# EAGLE schematic Main_wireless (EAGLE 7.1.0)
REV: 1.0
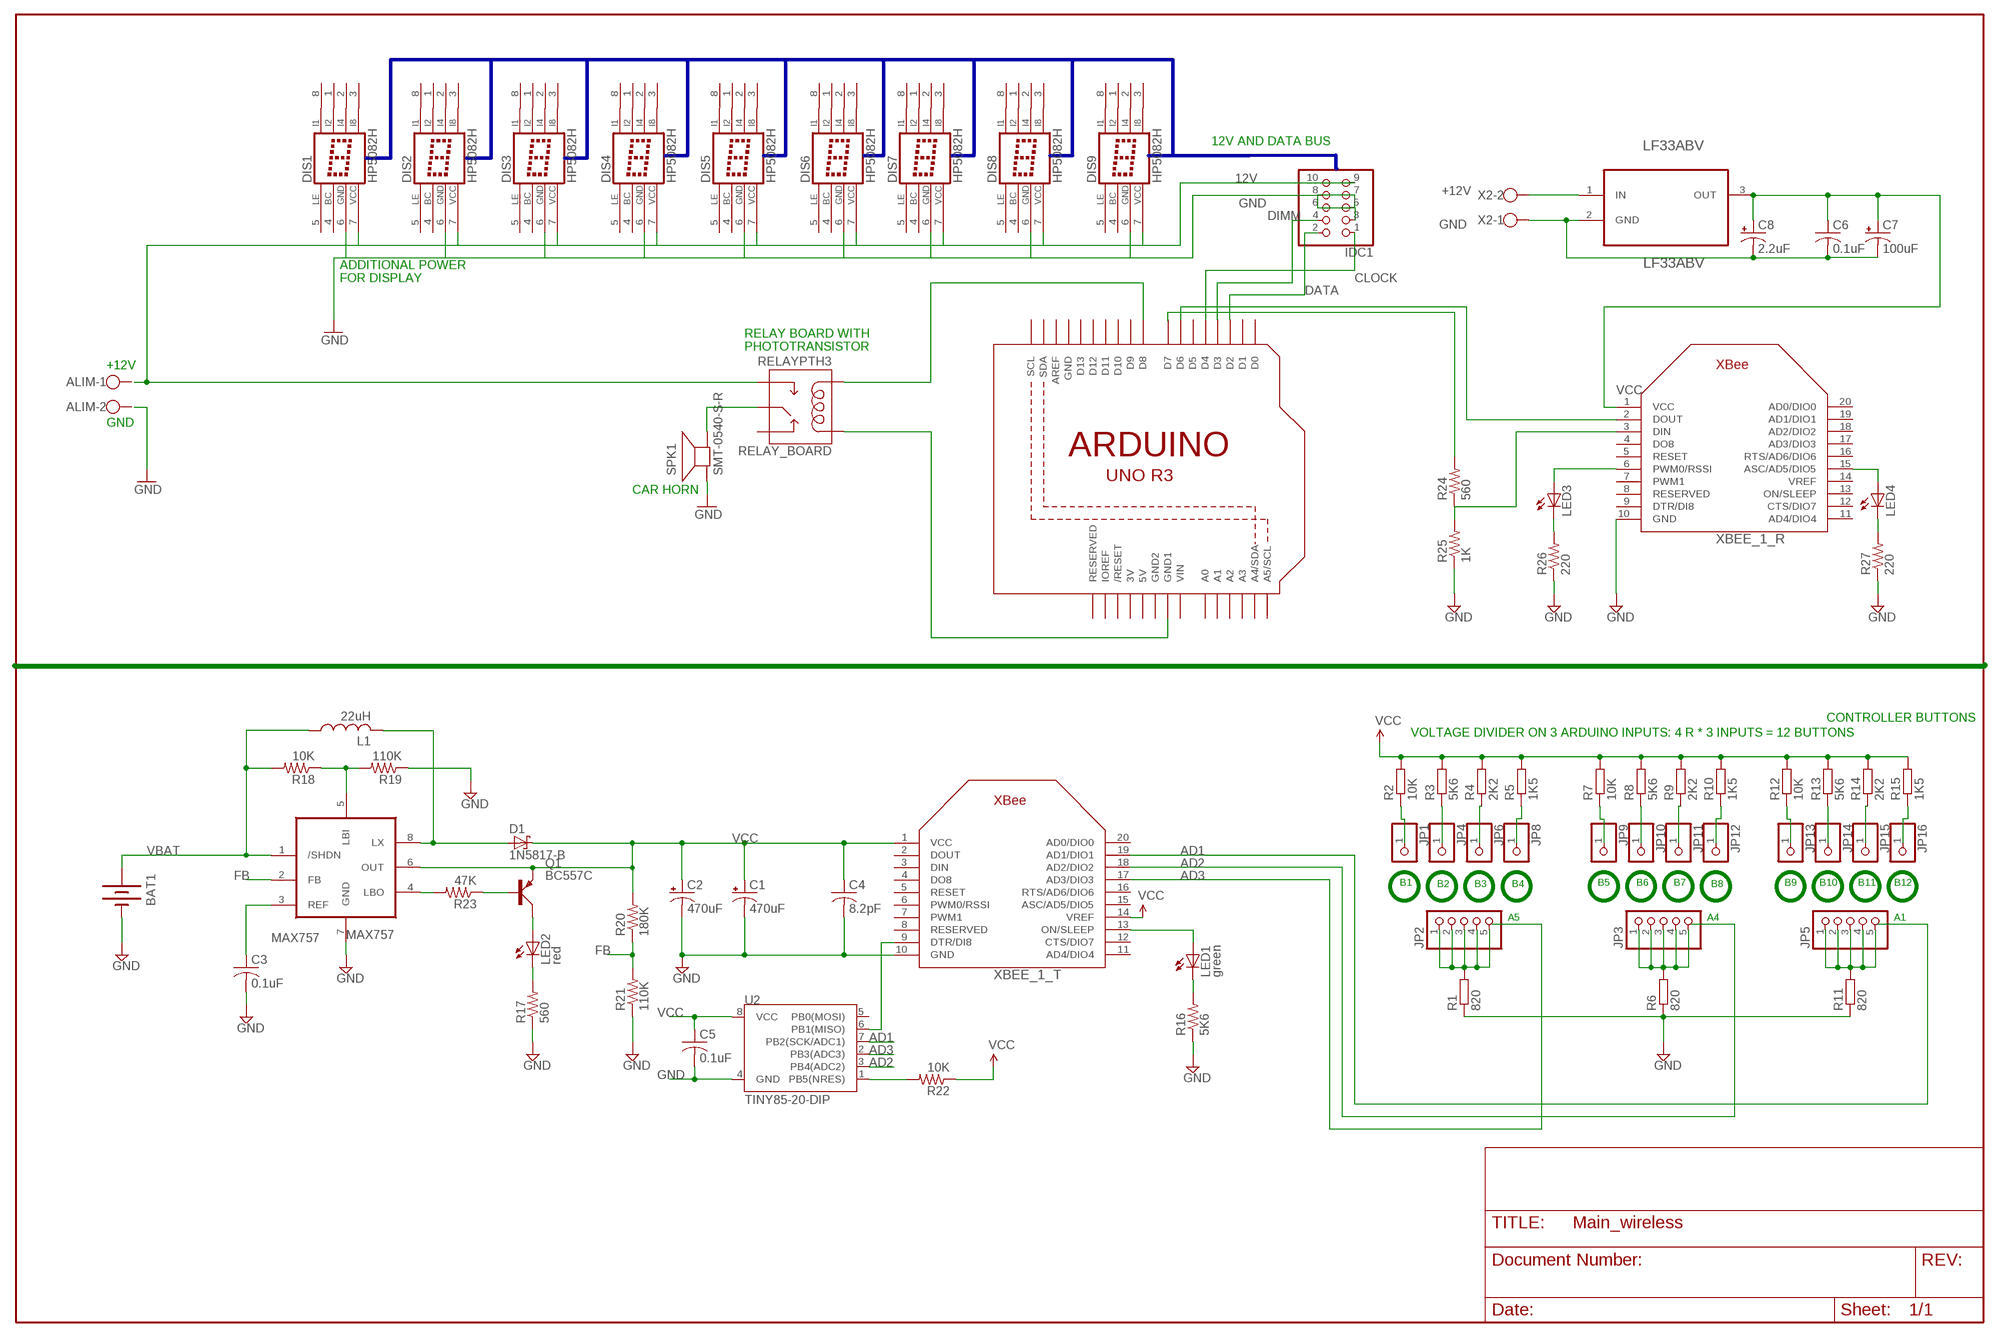
[diagram p0: schematic, sheet 1]

## Parts
ALIM  W237-102  [W237-102]
BAT1  BATTERY9V  [BATTCON_9V]
C1  470uF  CPOL-USE3.5-8  [E3,5-8]
C2  470uF  CPOL-USE3.5-8  [E3,5-8]
C3  0.1uF  C-US025-024X044  [C025-024X044]
C4  8.2pF  C-US025-024X044  [C025-024X044]
C5  0.1uF  C-US025-024X044  [C025-024X044]
C6  0.1uF  C-US025-024X044  [C025-024X044]
C7  100uF  CAP_POLPTH1  [CPOL-RADIAL-100UF-25V]
C8  2.2uF  CAP_POLPTH2  [CPOL-RADIAL-10UF-25V]
D1  1N5817-B  [DO41-7.6]
DIS1  HP5082H  [HP5082]
DIS2  HP5082H  [HP5082]
DIS3  HP5082H  [HP5082]
DIS4  HP5082H  [HP5082]
DIS5  HP5082H  [HP5082]
DIS6  HP5082H  [HP5082]
DIS7  HP5082H  [HP5082]
DIS8  HP5082H  [HP5082]
DIS9  HP5082H  [HP5082]
IDC1  PINHD-2X5  [2X05]
JP1  PINHD-1X1  [1X01]
JP2  PINHD-1X5  [1X05]
JP3  PINHD-1X5  [1X05]
JP4  PINHD-1X1  [1X01]
JP5  PINHD-1X5  [1X05]
JP6  PINHD-1X1  [1X01]
JP8  PINHD-1X1  [1X01]
JP9  PINHD-1X1  [1X01]
JP10  PINHD-1X1  [1X01]
JP11  PINHD-1X1  [1X01]
JP12  PINHD-1X1  [1X01]
JP13  PINHD-1X1  [1X01]
JP14  PINHD-1X1  [1X01]
JP15  PINHD-1X1  [1X01]
JP16  PINHD-1X1  [1X01]
L1  22uH  22R223C  [22R223C]
LED1  green  LED3MM  [LED3MM]
LED2  red  LED3MM  [LED3MM]
LED3  LED5MM  [LED5MM]
LED4  LED5MM  [LED5MM]
LF33ABV  LF33ABV  [TO254P450X1020X1935-3P]
MAX757  MAX757  [DIL08]
Q1  BC557C  [TO92D]
R1  820  R-EU_0207/12  [0207/12]
R2  10K  R-EU_0207/12  [0207/12]
R3  5K6  R-EU_0207/12  [0207/12]
R4  2K2  R-EU_0207/12  [0207/12]
R5  1K5  R-EU_0207/12  [0207/12]
R6  820  R-EU_0207/12  [0207/12]
R7  10K  R-EU_0207/12  [0207/12]
R8  5K6  R-EU_0207/12  [0207/12]
R9  2K2  R-EU_0207/12  [0207/12]
R10  1K5  R-EU_0207/12  [0207/12]
R11  820  R-EU_0207/12  [0207/12]
R12  10K  R-EU_0207/12  [0207/12]
R13  5K6  R-EU_0207/12  [0207/12]
R14  2K2  R-EU_0207/12  [0207/12]
R15  1K5  R-EU_0207/12  [0207/12]
R16  5K6  R-US_0207/10  [0207/10]
R17  560  R-US_0207/10  [0207/10]
R18  10K  R-US_0207/10  [0207/10]
R19  110K  R-US_0207/10  [0207/10]
R20  180K  R-US_0207/10  [0207/10]
R21  110K  R-US_0207/10  [0207/10]
R22  10K  R-US_0207/10  [0207/10]
R23  47K  R-US_0207/10  [0207/10]
R24  560  R-US_0207/10  [0207/10]
R25  1K  R-US_0207/10  [0207/10]
R26  220  R-US_0207/10  [0207/10]
R27  220  R-US_0207/10  [0207/10]
RELAY_BOARD  RELAYPTH3  [RELAY-T9A-2]
SPK1  SMT-0540-S-R  [SMT-0540-S-R]
U1  ARDUINOR3-DIMENSION  [ARDUINOR3]
U2  TINY85-20-DIP  ATTINY45TINY85-20-DIP  [DIP08]
X2  W237-102  [W237-102]
XBEE_1_R  XBEE  [XBEE]
XBEE_1_T  XBEE  [XBEE]

## Nets
12V: DIS1.7(VCC) DIS2.7(VCC) DIS3.7(VCC) DIS4.7(VCC) DIS5.7(VCC) DIS6.7(VCC) DIS7.7(VCC) DIS8.7(VCC) DIS9.7(VCC) IDC1.9 IDC1.10 RELAY_BOARD.NO
+12V [power]: LF33ABV.1(IN) X2.2
A1: JP3.1 JP3.2 JP3.3 JP3.4 JP3.5 R6.2
A2: JP5.1 JP5.2 JP5.3 JP5.4 JP5.5 R11.2
A3: JP2.1 JP2.2 JP2.3 JP2.4 JP2.5 R1.2
AD1: U2.7(PB2(SCK/ADC1)) XBEE_1_T.19(AD1/DIO1)
AD2: U2.3(PB4(ADC2)) XBEE_1_T.18(AD2/DIO2)
AD3: U2.2(PB3(ADC3)) XBEE_1_T.17(AD3/DIO3)
B1: JP1.1 R2.1
B2: JP4.1 R3.1
B3: JP6.1 R4.1
B4: JP8.1 R5.1
B5: JP9.1 R7.1
B6: JP10.1 R8.1
B7: JP11.1 R9.1
B8: JP12.1 R10.1
B9: JP13.1 R12.1
B10: JP14.1 R13.1
B11: JP15.1 R14.1
B12: JP16.1 R15.1
CLOCK: IDC1.1 U1.D4
DATA: IDC1.2 U1.D2
DIMM: IDC1.4 U1.D3
FB: MAX757.2(FB) R20.1 R21.2
GND: BAT1.- C1.- C2.- C3.2 C4.2 C5.2 C6.2 C7.2(-) C8.2(-) DIS1.6(GND) DIS2.6(GND) DIS3.6(GND) DIS4.6(GND) DIS5.6(GND) DIS6.6(GND) DIS7.6(GND) DIS8.6(GND) DIS9.6(GND) IDC1.3 IDC1.5 IDC1.6 IDC1.7 IDC1.8 LF33ABV.2(GND) MAX757.7(GND) R1.1 R6.1 R11.1 R16.1 R17.1 R19.1 R21.1 R25.1 R26.1 R27.1 SPK1.-(+) U2.4(GND) X2.1 XBEE_1_R.10(GND) XBEE_1_T.10(GND)
GND1: RELAY_BOARD.COIL1 U1.GND1
N$1: RELAY_BOARD.MAIN SPK1.+(-)
N$2: RELAY_BOARD.COIL2 U1.D8
N$3: LED3.K(C) R26.2
N$4: LED3.A XBEE_1_R.6(PWM0/RSSI)
N$5: R24.1 R25.2 XBEE_1_R.3(DIN)
N$6: U2.6(PB1(MISO)) XBEE_1_T.9(DTR/DI8)
N$8: LED1.A XBEE_1_T.13(ON/SLEEP)
N$9: LED1.K(C) R16.2
N$10: D1.A L1.P$2 MAX757.8(LX)
N$11: C3.1 MAX757.3(REF)
N$12: MAX757.5(LBI) R18.1 R19.2
N$13: R22.2 U2.1(PB5(NRES))
N$14: MAX757.4(LBO) R23.2
N$15: LED2.K(C) R17.2
N$16: Q1.B R23.1
N$17: LED2.A Q1.C
N$18: LED4.A XBEE_1_R.15(ASC/AD5/DIO5)
N$19: LED4.K(C) R27.2
N$20: R24.2
TX-3.3V-TO-MICRO: U1.D6 XBEE_1_R.2(DOUT)
VBAT [power]: BAT1.+ L1.P$1 MAX757.1(/SHDN) R18.2
VCC: C1.+ C2.+ C4.1 C5.1 C6.1 C7.1(+) C8.1(+) D1.C LF33ABV.3(OUT) MAX757.6(OUT) Q1.E R2.2 R3.2 R4.2 R5.2 R7.2 R8.2 R9.2 R10.2 R12.2 R13.2 R14.2 R15.2 R20.2 R22.1 U2.8(VCC) XBEE_1_R.1(VCC) XBEE_1_T.1(VCC) XBEE_1_T.14(VREF)
Unconnected: ALIM.1 ALIM.2 DIS1.1(I2) DIS1.2(I4) DIS1.3(I8) DIS1.4(BC) DIS1.5(LE) DIS1.8(I1) DIS2.1(I2) DIS2.2(I4) DIS2.3(I8) DIS2.4(BC) DIS2.5(LE) DIS2.8(I1) DIS3.1(I2) DIS3.2(I4) DIS3.3(I8) DIS3.4(BC) DIS3.5(LE) DIS3.8(I1) DIS4.1(I2) DIS4.2(I4) DIS4.3(I8) DIS4.4(BC) DIS4.5(LE) DIS4.8(I1) DIS5.1(I2) DIS5.2(I4) DIS5.3(I8) DIS5.4(BC) DIS5.5(LE) DIS5.8(I1) DIS6.1(I2) DIS6.2(I4) DIS6.3(I8) DIS6.4(BC) DIS6.5(LE) DIS6.8(I1) DIS7.1(I2) DIS7.2(I4) DIS7.3(I8) DIS7.4(BC) DIS7.5(LE) DIS7.8(I1) DIS8.1(I2) DIS8.2(I4) DIS8.3(I8) DIS8.4(BC) DIS8.5(LE) DIS8.8(I1) DIS9.1(I2) DIS9.2(I4) DIS9.3(I8) DIS9.4(BC) DIS9.5(LE) DIS9.8(I1) RELAY_BOARD.NC U1.A0 U1.A1 U1.A2 U1.A3 U1.A4(A4/SDA) U1.A5(A5/SCL) U1.AREF U1.D0 U1.D1 U1.D5 U1.D7 U1.D9 U1.D10 U1.D11 U1.D12 U1.D13 U1.IOREF U1.RESERVED U1.RESET(/RESET) U1.SCL U1.SDA U2.5(PB0(MOSI)) XBEE_1_R.4(DO8) XBEE_1_R.5(RESET) XBEE_1_R.7(PWM1) XBEE_1_R.8(RESERVED) XBEE_1_R.9(DTR/DI8) XBEE_1_R.11(AD4/DIO4) XBEE_1_R.12(CTS/DIO7) XBEE_1_R.13(ON/SLEEP) XBEE_1_R.14(VREF) XBEE_1_R.16(RTS/AD6/DIO6) XBEE_1_R.17(AD3/DIO3) XBEE_1_R.18(AD2/DIO2) XBEE_1_R.19(AD1/DIO1) XBEE_1_R.20(AD0/DIO0) XBEE_1_T.2(DOUT) XBEE_1_T.3(DIN) XBEE_1_T.4(DO8) XBEE_1_T.5(RESET) XBEE_1_T.6(PWM0/RSSI) XBEE_1_T.7(PWM1) XBEE_1_T.8(RESERVED) XBEE_1_T.11(AD4/DIO4) XBEE_1_T.12(CTS/DIO7) XBEE_1_T.15(ASC/AD5/DIO5) XBEE_1_T.16(RTS/AD6/DIO6) XBEE_1_T.20(AD0/DIO0)

## Buses
B$1
B$2

## Notes on the sheet
- 12V AND DATA BUS
- ADDITIONAL POWER
  FOR DISPLAY
- RELAY BOARD WITH
  PHOTOTRANSISTOR
- +12V
- GND
- CAR HORN
- CONTROLLER BUTTONS
- VOLTAGE DIVIDER ON 3 ARDUINO INPUTS: 4 R * 3 INPUTS = 12 BUTTONS
- B1 | B2 | B3 | B4 | B5 | B6 | B7 | B8 | B9 | B10 | B11 | B12
- A5 | A4 | A1

## Power pins joined to a net without a drawn wire
3V: U1.3V
5V: U1.5V
GND: U1.GND
GND2: U1.GND2
VIN: U1.VIN

## Library data of the parts
ALIM X2 = con-wago-500:W237-102: WAGO SCREW CLAMP; MPN: 237-102; OC_FARNELL: unknown; OC_NEWARK: 70K9898
BAT1 = SparkFun-Electromechanical:BATTERY: Battery Holders Various common sizes : AA, AAA, 20mm coin cell and 12mm coin cell. 20MM_4LEGS, BATT-10373
C1 C2 = adafruit:CPOL-US: POLARIZED CAPACITOR, American symbol
C3-C6 = adafruit:C-US: CAPACITOR, American symbol
C7 C8 = SparkFun-Capacitors:CAP_POL: Capacitor Polarized These are standard SMD and PTH capacitors. Normally 10uF, 47uF, and 100uF in electrolytic and tantalum varieties. Always verify the external diameter of the through hole cap, it varies with capacity, voltage, and manufacturer. The EIA devices should be standard.
D1 = diode:1N581*: 1.0A SCHOTTKY BARRIER RECTIFIER Source: http://www.diodes.com/datasheets/ds23001.pdf
DIS1-DIS9 = display-hp:HP5082H: LED DISPLAY 1-character dot matrix, 2 decimal points; OC_FARNELL: unknown; OC_NEWARK: unknown
IDC1 = pinhead:PINHD-2X5: PIN HEADER
JP1 JP4 JP6 JP8-JP16 = pinhead:PINHD-1X1: PIN HEADER
JP2 JP3 JP5 = pinhead:PINHD-1X5: PIN HEADER
L1 = CuSTOM_GB:22R223C
LED1 LED2 = led:LED: LED
LED3 LED4 = adafruit:LED: LED
LF33ABV = ST Microelctronics_By_element14_Batch_1:LF33ABV: Very low drop voltage regulators with inhibit; MPN: LF33ABV; OC_FARNELL: 1087184; OC_NEWARK: 26M0228; PACKAGE: TO-220; SUPPLIER: STMicroelectronics
MAX757 = adafruit:MAX757
Q1 = CuSTOM_GB:BC557C: PNP 557 Transistor (E - 1, B - 2, C - 3)
R1-R15 = resistor:R-EU_: RESISTOR, European symbol
R16 R18 R22 = rcl:R-US_: RESISTOR, American symbol
R17 R19-R21 R23 R26 R27 = resistor:R-US_: RESISTOR, American symbol
R24 R25 = adafruit:R-US_: RESISTOR, American symbol
RELAY_BOARD = SparkFun:RELAY
SPK1 = adafruit:SMT-0540-S-R: SMT-0549-S-R Small surface-mount magnetic buzzer
U1 = adafruit:ARDUINOR3: This is a new object for the new Arduino R3 - with extra pins that you may want to use (such as IOref, and duplicated A4/A5
U2 = SparkFun-DigitalIC:ATTINY45: Atmel 8-pin 2/4/8kB flash uC; PROD_ID: IC-09445
XBEE_1_R XBEE_1_T = adafruit:XBEE

## Net classes
0 signal: width 0.508 mm, drill 0.508 mm, clearance 0.381 mm
1 power: width 0.635 mm, drill 0.508 mm, clearance 0.559 mm